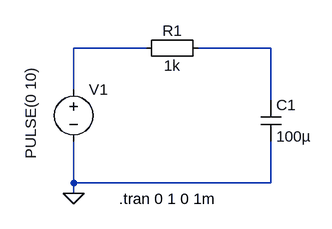
[diagram p0: schematic Kondensator_Laden.asc]
Kondensator_Laden.asc, the LTspice schematic file:
Version 4
SHEET 1 880 680
WIRE 208 64 96 64
WIRE 400 64 288 64
WIRE 96 128 96 64
WIRE 400 144 400 64
WIRE 96 272 96 208
WIRE 400 272 400 208
WIRE 400 272 96 272
WIRE 96 288 96 272
FLAG 96 288 0
SYMBOL voltage 96 112 R0
WINDOW 3 -66 -19 VRight 2
WINDOW 123 0 0 Left 0
WINDOW 39 0 0 Left 0
SYMATTR InstName V1
SYMATTR Value PULSE(0 10)
SYMBOL Misc\\EuropeanResistor 304 48 R90
WINDOW 0 5 56 VBottom 2
WINDOW 3 27 56 VTop 2
SYMATTR InstName R1
SYMATTR Value 1k
SYMBOL cap 384 144 R0
SYMATTR InstName C1
SYMATTR Value 100µ
SYMATTR SpiceLine Rser=1m
TEXT 166 296 Left 2 !.tran 0 1 0 1m

The netlist it stands for:
* Kondensator_Laden.asc
V1 N001 0 PULSE(0 10)
R1 N002 N001 1k
C1 N002 0 100µ Rser=1m
.tran 0 1 0 1m
.backanno
.end